# EAGLE design Hallsonde (EAGLE 7.0.0)
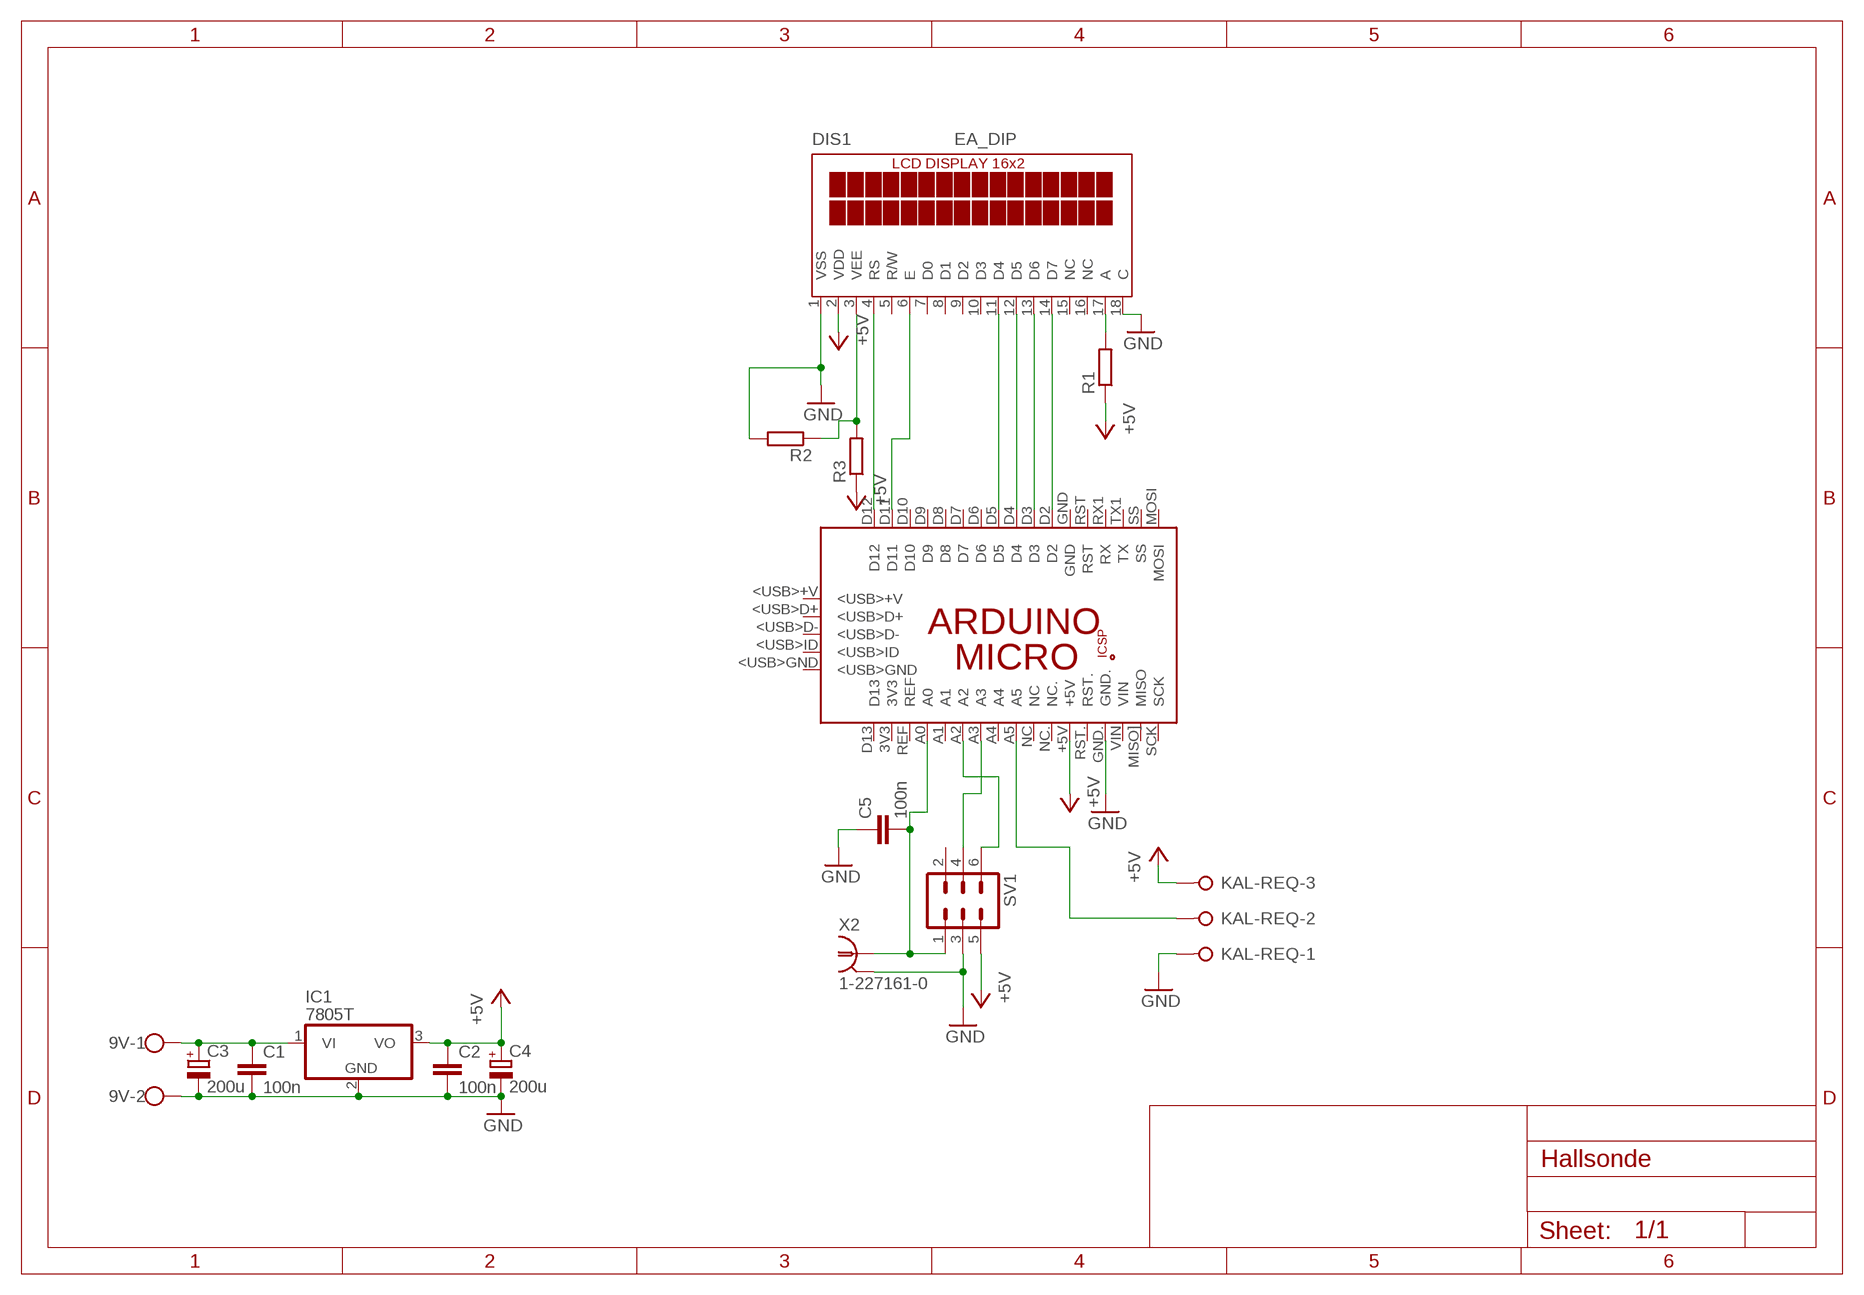
[diagram p0: schematic, sheet 1]

## Parts
9V  W237-102  [W237-102]
C1  100n  C-EUC0805  [C0805]
C2  100n  C-EUC0805  [C0805]
C3  200u  CPOL-EUE2,5-6E  [E2,5-6E]
C4  200u  CPOL-EUE2,5-6E  [E2,5-6E]
C5  100n  C-EUC0805  [C0805]
DIS1  EA_DIP  [EA_DIP]
IC1  7805T  [TO220H]
KAL-REQ  W237-3E  [W237-3E]
PCB1  ARDUINO_MICRO  [ARDUINO_MICRO]
R1  R-EU_M0805  [M0805]
R2  R-EU_M0805  [M0805]
R3  R-EU_M0805  [M0805]
SV1  ML6L  [ML6L]
X2  1-227161-0  [AMP_227161]

## Nets
+5V: C2.1 C4.+ DIS1.2(VDD) IC1.3(VO) KAL-REQ.3 PCB1.+5V R1.1 R3.1 SV1.5
GND: 9V.2 C1.2 C2.2 C3.- C4.- C5.1 DIS1.1(VSS) DIS1.18(C) IC1.2(GND) KAL-REQ.1 PCB1.GND. R2.2 SV1.3 X2.2
N$1: 9V.1 C1.1 C3.+ IC1.1(VI)
N$2: DIS1.4(RS) PCB1.D12
N$3: DIS1.6(E) PCB1.D11
N$4: DIS1.11(D4) PCB1.D5
N$5: DIS1.12(D5) PCB1.D4
N$6: DIS1.13(D6) PCB1.D3
N$7: DIS1.14(D7) PCB1.D2
N$8: DIS1.17(A) R1.2
N$9: C5.2 PCB1.A0 SV1.1 X2.1
N$10: PCB1.A3 SV1.4
N$11: PCB1.A2 SV1.6
N$12: KAL-REQ.2 PCB1.A5
N$14: DIS1.3(VEE) R2.1 R3.2
Unconnected: DIS1.5(R/W) DIS1.7(D0) DIS1.8(D1) DIS1.9(D2) DIS1.10(D3) DIS1.15(NC) DIS1.16(NC) PCB1.3V3 PCB1.5V PCB1.<USB>+V PCB1.<USB>D+ PCB1.<USB>D- PCB1.<USB>GND PCB1.<USB>ID PCB1.A1 PCB1.A4 PCB1.D6 PCB1.D7 PCB1.D8 PCB1.D9 PCB1.D10 PCB1.D13 PCB1.GND PCB1.GND_ PCB1.MISO. PCB1.MISO](MISO) PCB1.MOSI PCB1.MOSI. PCB1.NC PCB1.NC. PCB1.REF PCB1.RESET.. PCB1.RST PCB1.RST. PCB1.RX1(RX) PCB1.SCK PCB1.SCK. PCB1.SS PCB1.TX1(TX) PCB1.VIN SV1.2

## Library data of the parts
9V = con-wago-500:W237-102: WAGO SCREW CLAMP; MPN: 237-102; OC_FARNELL: unknown; OC_NEWARK: 70K9898
C1 C2 C5 = rcl:C-EU: CAPACITOR, European symbol
C3 C4 = rcl:CPOL-EU: POLARIZED CAPACITOR, European symbol
DIS1 = display-lcd:EA_DIP: LCD-MODUL 2x16 - 6,68mm, INKL. KONTROLLER HD44780 Source: Data sheet <http://www.lcd-module.de/pdf/doma/dip162-d.pdf>
IC1 = linear:78*: Positive VOLTAGE REGULATOR Source: http://cache.national.com/ds/LM/LM78L05.pdf http://www.fairchildsemi.com/ds/LM/LM7805.pdf
KAL-REQ = con-wago-508:W237-3E: WAGO SREW CLAMP; OC_FARNELL: unknown; OC_NEWARK: unknown
PCB1 = E14_Arduino:ARDUINO_MICRO: Device for representing an Arduino Micro board with a footprint in an EAGLE design. Created by Dave Young for Element14. More EAGLE documentation at: http://www.element14.com/community/community/knode/cadsoft_eagle
R1-R3 = rcl:R-EU_: RESISTOR, European symbol
SV1 = con-harting-ml:ML6: HARTING; OC_FARNELL: unknown; OC_NEWARK: unknown
X2 = con-coax:?227161*: JACK, RIGHT ANGLE, 50 OHM, PCB, BNC Source: amp_227161.pdf; MF: TYCO ELECTRONICS; MPN: 1-227161; OC_FARNELL: unknown; OC_NEWARK: 33B3200

## Board
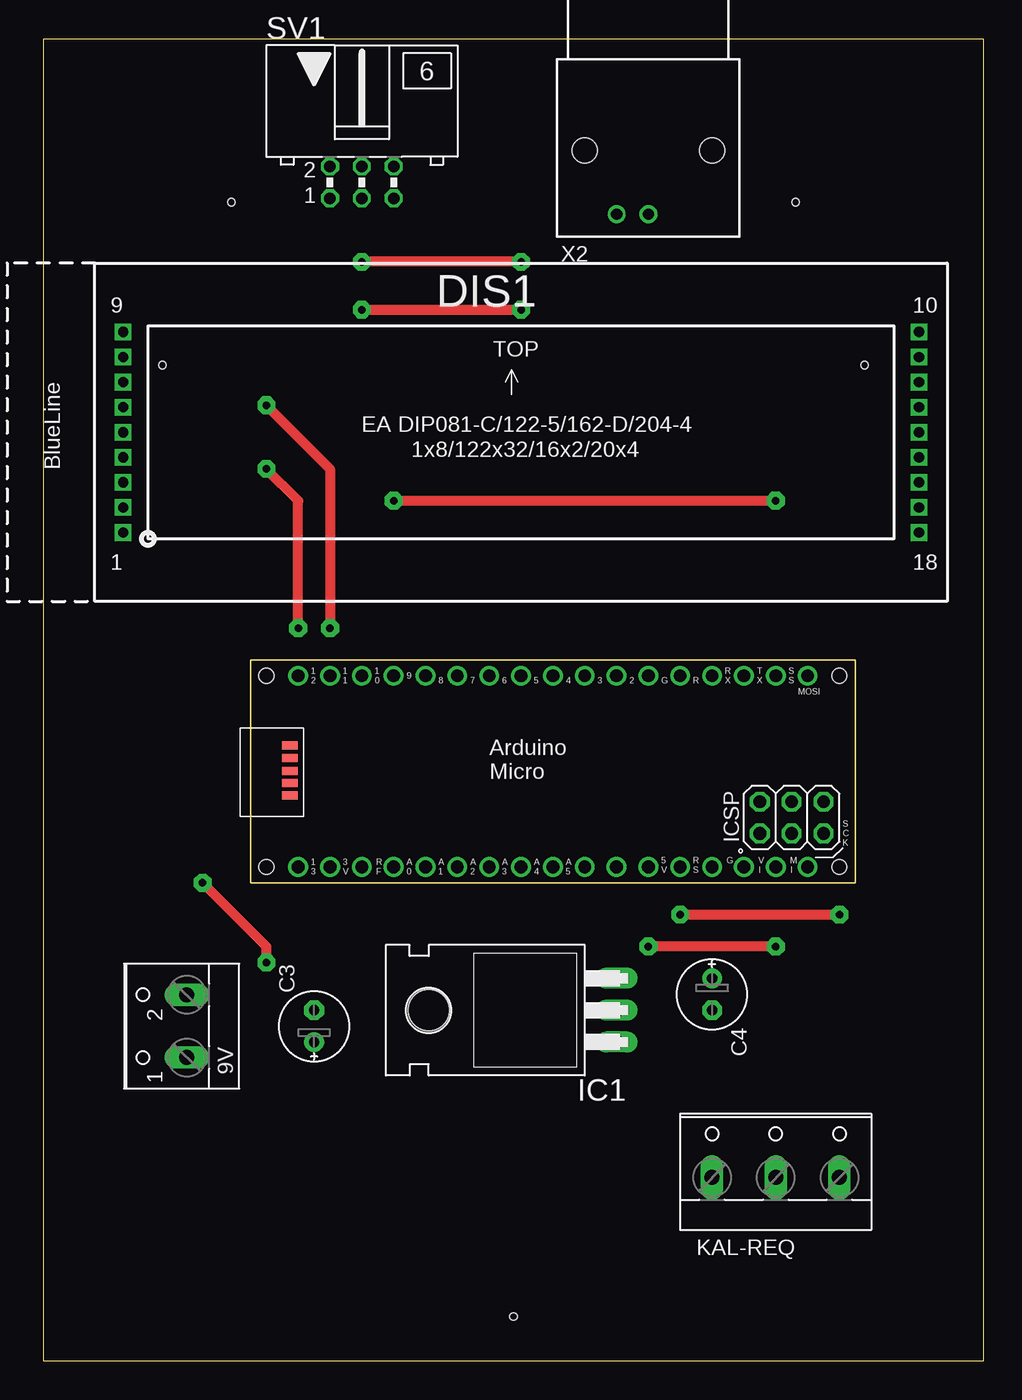
[diagram p1: board, top side]
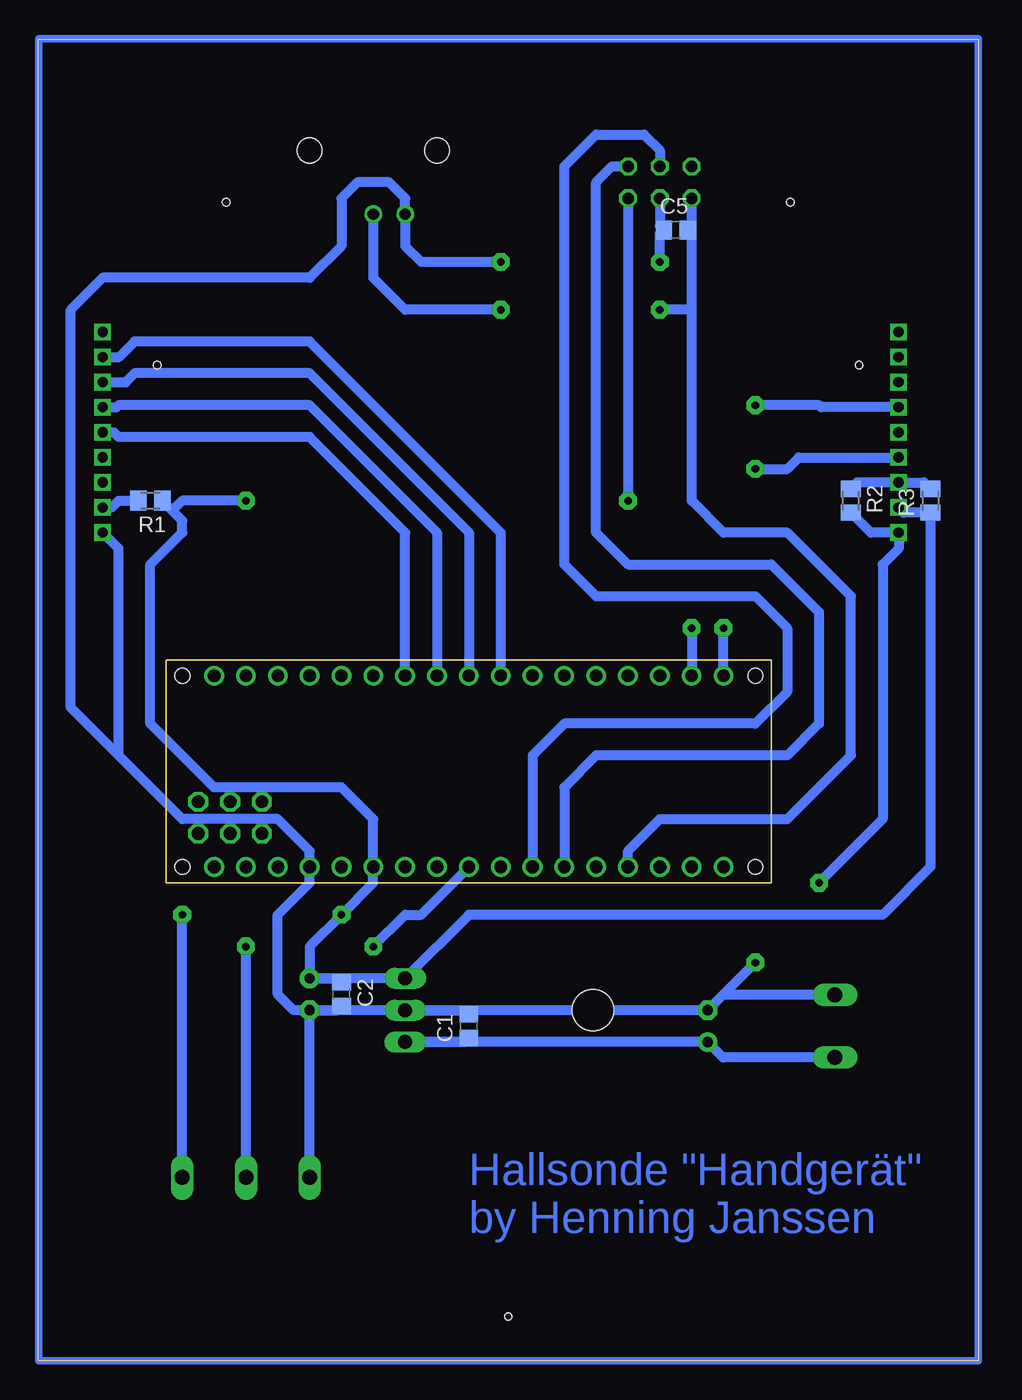
[diagram p2: board, bottom side, seen from below]

Size 75 x 105.4 mm. Coordinates in mm from the lower left corner, seen from the top.
Outline: 0,0 75,0 75,105.4 0,105.4 0,0
Copper layers (1*16): Top 0.035mm / dielectric 1.5mm / Bottom 0.035mm
Design rules "default": minimum track width 10mil, minimum drill 24mil, track to track 8mil, track to pad 8mil, pad to pad 8mil, via to via 8mil, smd to smd 8mil, copper to edge 40mil, drill to drill 8mil, minimum pad ring 10mil, minimum via ring 8mil, stop-mask expansion 4mil, vias tented up to drill 0mil, thermal gap 10mil
Holes 0.6 mm at 15,92.4 60,92.4 65.5,79.4 9.5,79.4 37.5,3.5

### Footprints (pad centres in the part's own frame; a part is rotated, then mirrored left to right if it is on the bottom)
W237-102 = drill 1.194 long: 1 -2.5,-1.27; 2 2.5,-1.27
C0805 = smd 1.3 x 1.5: 1 -0.95,0; 2 0.95,0
E2,5-6E = drill 0.813 pad 1.575: + -1.27,0 | drill 0.813 pad 1.575 octagon: - 1.27,0
EA_DIP = drill 0.813 pad 1.27 square: 1 0,0; 2 0,2; 3 0,4; 4 0,6; 5 0,8; 6 0,10; 7 0,12; 8 0,14; 9 0,16; 10 63.5,16; 11 63.5,14; 12 63.5,12; 13 63.5,10; 14 63.5,8; 15 63.5,6; 16 63.5,4; 17 63.5,2; 18 63.5,0
TO220H = drill 1.118 long: 1 -2.54,-10.16; 2 0,-10.16; 3 2.54,-10.16 | hole 3.302: 0,4.826
W237-3E = drill 1.194 long: 1 -5.08,-0.635; 2 0,-0.635; 3 5.08,-0.635
ARDUINO_MICRO = drill 1.016 pad 1.575: 3V3 6.35,1.27; +5V 31.75,1.27; A0 11.43,1.27; A1 13.97,1.27; A2 16.51,1.27; A3 19.05,1.27; A4 21.59,1.27; A5 24.13,1.27; D2 29.21,16.51; D3 26.67,16.51; D4 24.13,16.51; D5 21.59,16.51; D6 19.05,16.51; D7 16.51,16.51; D8 13.97,16.51; D9 11.43,16.51; D10 8.89,16.51; D11 6.35,16.51; D12 3.81,16.51; D13 3.81,1.27; GND 31.75,16.51; GND. 36.83,1.27; MISO] 41.91,1.27; MOSI 44.45,16.51; NC 26.67,1.27; NC. 29.21,1.27; REF 8.89,1.27; RST 34.29,16.51; RST. 34.29,1.27; RX1 36.83,16.51; SCK 44.45,1.27; SS 41.91,16.51; TX1 39.37,16.51; VIN 39.37,1.27 | drill 1.016 pad 1.575 octagon: 5V 40.64,6.477; GND_ 45.72,6.477; MISO. 40.64,3.937; MOSI. 43.18,6.477; RESET.. 45.72,3.937; SCK. 43.18,3.937 | smd 1.27 x 0.635: <USB>+V 3.15,10.947; <USB>D+ 3.15,9.957; <USB>D- 3.15,8.941; <USB>GND 3.15,6.96; <USB>ID 3.15,7.976 | hole 1.2: 1.27,1.27; 1.27,16.51; 46.99,16.51; 46.99,1.27
M0805 = smd 1.3 x 1.6: 1 -0.95,0; 2 0.95,0
ML6L = drill 0.914 octagon: 1 -2.54,-1.27; 2 -2.54,1.27; 3 0,-1.27; 4 0,1.27; 5 2.54,-1.27; 6 2.54,1.27
AMP_227161 = drill 0.9 pad 1.27: 1 0,-5.08; 2 -2.54,-5.08 | hole 2: -5.08,0; 5.08,0

### Placement (x,y rotation side)
9V  10.16,26.67 90 top
C1  40.64,26.67 90 bottom
C2  50.8,29.21 270 bottom
C3  21.59,26.67 90 top
C4  53.34,29.21 270 top
C5  24.13,90.17 0 bottom
DIS1  6.35,66.04 0 top
IC1  35.56,27.94 90 top
KAL-REQ  58.42,15.24 0 top
PCB1  16.51,38.1 0 top
R1  66.04,68.58 180 bottom
R2  10.16,68.58 270 bottom
R3  3.81,68.58 90 bottom
SV1  25.4,93.98 0 top
X2  48.26,96.52 0 top

### Tracks (layer width: path | path; a pad name or v marks a point on that pad's centre or on a via)
+5V  (via drill 0.6 pad 1.42)
  Top 0.813: v27.94,68.58 v58.42,68.58 | v63.5,35.56 v50.8,35.56
  Bottom 0.813: C4.+ IC1.3 40.64,35.56 7.62,35.56 3.81,39.37 R3.1 5.94,67.63 DIS1.2 | C4.+ 51.12,30.48 C2.1 | 64.3,67.78 63.5,66.99 63.5,66.04 66.04,63.5 66.04,50.8 60.96,45.72 50.8,45.72 48.26,43.18 PCB1.+5V 48.26,38.1 v50.8,35.56 53.34,33.02 C4.+ | 64.3,67.78 R1.1 | SV1.5 v27.94,68.58 | v58.42,68.58 63.5,68.58 64.3,67.78 | KAL-REQ.3 v63.5,35.56
GND  (via drill 0.6 pad 1.42)
  Top 0.813: v12.7,38.1 17.78,33.02 v17.78,31.75 | v38.1,87.63 v25.4,87.63
  Bottom 0.813: 9V.2 20.36,29.17 | 20.36,29.17 C3.- IC1.2 | IC1.2 40.96,27.94 C1.2 | IC1.2 C4.- | C4.- 51.12,27.94 C2.2 | C4.- 54.61,27.94 55.88,29.21 55.88,35.56 53.34,38.1 PCB1.GND. 53.34,40.64 55.88,43.18 63.5,43.18 68.58,48.26 | 68.58,48.26 68.58,64.77 DIS1.18 | R2.2 8.57,66.04 DIS1.1 6.35,64.77 7.62,63.5 7.62,43.18 v12.7,38.1 | v17.78,31.75 20.36,29.17 | KAL-REQ.1 C4.- | 68.58,48.26 72.39,52.07 72.39,83.82 69.85,86.36 53.34,86.36 50.8,88.9 50.8,92.71 49.53,93.98 46.99,93.98 45.72,92.71 X2.2 45.72,88.9 44.45,87.63 v38.1,87.63 | SV1.3 25.4,90.49 C5.1 25.4,89.85 v25.4,87.63
N$1
  Bottom 0.813: 9V.1 20.36,24.17 C3.+ IC1.1 40.96,25.4 C1.1
N$2  (via drill 0.6 pad 1.42)
  Top 0.813: v20.32,58.42 20.32,68.58 v17.78,71.12
  Bottom 0.813: PCB1.D12 v20.32,58.42 | v17.78,71.12 15.24,71.12 14.32,72.04 DIS1.4
N$3  (via drill 0.6 pad 1.42)
  Top 0.813: v17.78,76.2 22.86,71.12 v22.86,58.42
  Bottom 0.813: DIS1.6 12.54,76.04 12.7,76.2 v17.78,76.2 | v22.86,58.42 PCB1.D11
N$4
  Bottom 0.813: DIS1.11 68.55,80.04 67.31,81.28 53.34,81.28 38.1,66.04 PCB1.D5
N$5
  Bottom 0.813: DIS1.12 68.01,78.04 67.31,78.74 53.34,78.74 40.64,66.04 PCB1.D4
N$6
  Bottom 0.813: DIS1.13 68.74,76.04 68.58,76.2 53.34,76.2 43.18,66.04 PCB1.D3
N$7
  Bottom 0.813: DIS1.14 68.96,74.04 68.58,73.66 53.34,73.66 45.72,66.04 PCB1.D2
N$8
  Bottom 0.813: DIS1.17 69.12,68.04 68.58,68.58 R1.2
N$9  (via drill 0.6 pad 1.42)
  Top 0.813: v25.4,83.82 v38.1,83.82
  Bottom 0.813: PCB1.A0 27.94,40.64 25.4,43.18 15.24,43.18 10.16,48.26 10.16,60.96 15.24,66.04 20.32,66.04 22.86,68.58 22.86,83.82 | 22.86,83.82 22.86,90.49 | 22.86,90.49 SV1.1 22.86,93.03 | C5.2 22.86,90.49 | X2.1 48.26,86.36 45.72,83.82 v38.1,83.82 | 22.86,83.82 v25.4,83.82
N$10
  Bottom 0.813: PCB1.A3 35.56,48.26 33.02,50.8 17.78,50.8 15.24,53.34 15.24,58.42 17.78,60.96 30.48,60.96 33.02,63.5 33.02,95.25 30.48,97.79 26.67,97.79 25.4,96.52 SV1.4
N$11
  Bottom 0.813: PCB1.A2 33.02,45.72 30.48,48.26 15.24,48.26 12.7,50.8 12.7,59.69 16.51,63.5 27.94,63.5 30.48,66.04 30.48,93.98 29.21,95.25 SV1.6
N$12  (via drill 0.6 pad 1.42)
  Top 0.813: v58.42,33.02 v48.26,33.02
  Bottom 0.813: PCB1.A5 44.45,35.56 45.72,35.56 v48.26,33.02 | KAL-REQ.2 v58.42,33.02
N$14
  Bottom 0.813: R3.2 4.32,70.04 DIS1.3 9.65,70.04 R2.1
N$16
  Bottom 0.61: 0,0 74.93,0 74.93,105.41 0,105.41 0,0

### Text on the board
Top: TOP-Layer wird / per Hand / verdrahtet
Bottom: Hallsonde "Handgerät" / by Henning Janssen